# EAGLE design IUWASH_PIPE (EAGLE 6.5.0)
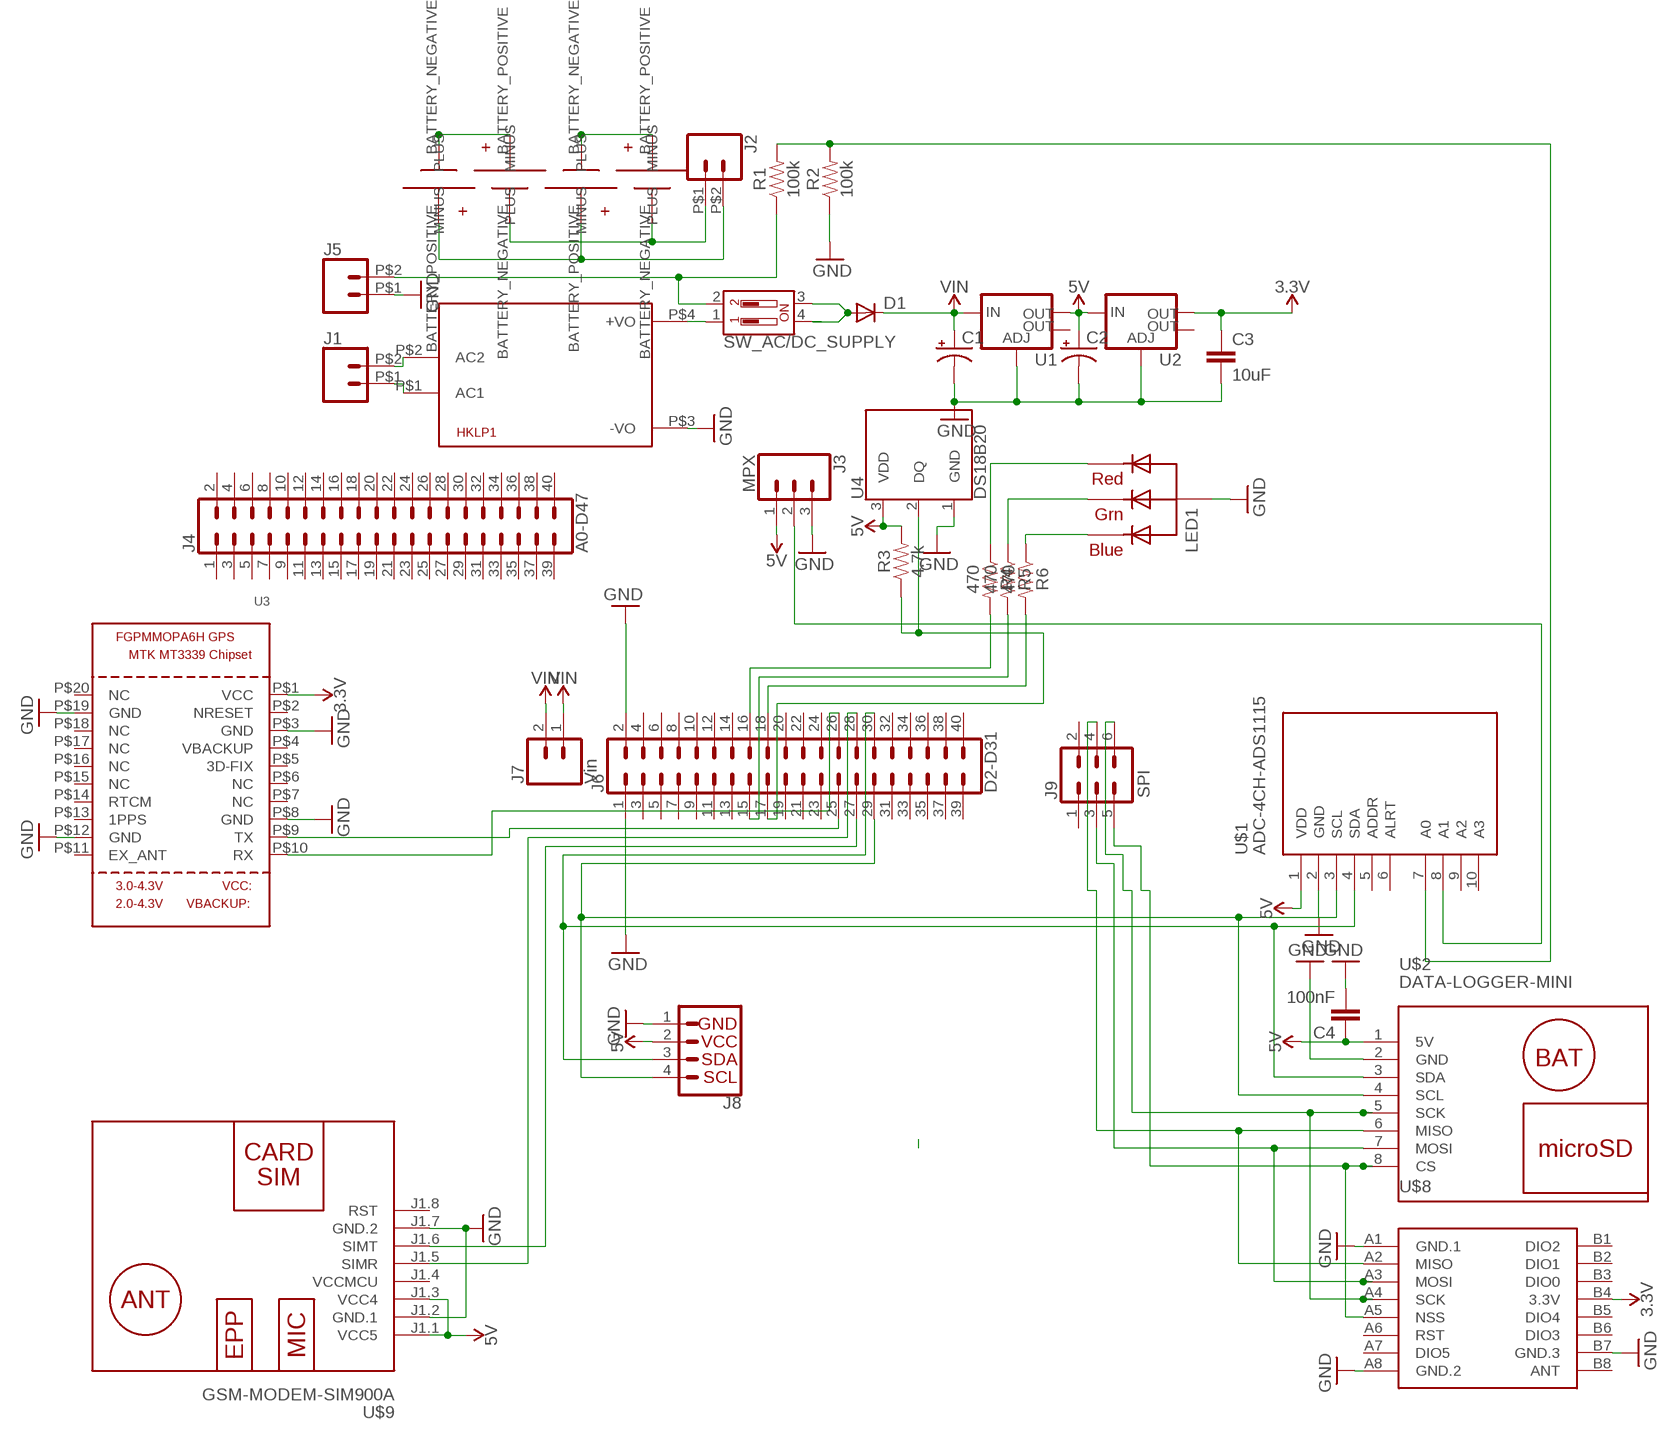
[diagram p0: schematic, sheet 1]

## Parts
C1  CPOL-USE  [PANASONIC_E]
C2  CPOL-USE  [PANASONIC_E]
C3  10uF  10UF-0603-6.3V-20%  [0603]
C4  100nF  10UF-0603-6.3V-20%  [0603]
D1  DIODE-SOD106-W  [SOD106-W]
HKLP1  HKLPM01  [HKLPM01]
J1  CONN_02PTH2  [1X02_BIG]
J2  CONN_02PTH2  [1X02_BIG]
J3  MPX  CONN_03SCREW  [SCREWTERMINAL-3.5MM-3]
J4  A0-D47  CONN_20X2  [2X20]
J5  CONN_02PTH2  [1X02_BIG]
J6  D2-D31  CONN_20X2  [2X20]
J7  Vin  CONN_02  [1X02]
J8  I2C_STANDARD  [1X04]
J9  SPI  CONN_03X2FEMALE  [2X3]
LED1  RGBLED_CA-5MM  [LED5MMRGB]
R1  100k  1KOHM-0603-1/10W-1%  [0603]
R2  100k  1KOHM-0603-1/10W-1%  [0603]
R3  4.7k  4.7KOHM-0603-1/10W-1%  [0603]
R4  470  1KOHM-0603-1/10W-1%  [0603]
R5  470  1KOHM-0603-1/10W-1%  [0603]
R6  470  1KOHM-0603-1/10W-1%  [0603]
SW_AC/DC_SUPPLY  DIP-02-PTH-100MIL  [DIPSWITCH-02-209-2LPST]
U1  V_REG_LM1117SOT223  [SOT223]
U2  V_REG_LM1117SOT223  [SOT223]
U3  GPS_FGPMMOPA6H  [FGPMMOPA6H]
U4  DS18B20  [TO-92-AMMO]
U$1  ADC-4CH-ADS1115  [ADC-4CH-ADS1115]
U$2  DATA-LOGGER-MINI  [DATA-LOGGER-MINI]
U$4  SMT18650  [18650SMT]
U$5  SMT18650  [18650SMT]
U$6  SMT18650  [18650SMT]
U$7  SMT18650  [18650SMT]
U$8  WIRELESS-LORA-RFM95W#SMD  [WIRELESS-LORA-RFM95W#SMD]
U$9  GSM-MODEM-SIM900A  [GSM-MODEM-SIM900A]

## Nets
3.3V: C3.1 U2.2(OUT) U3.P$1(VCC) U$8.B4(3.3V)
5V: C1.+ C2.+ C4.1 D1.C J3.1 J7.1 J7.2 R3.2 U1.2(OUT) U1.3(IN) U2.3(IN) U4.3(VDD) U$1.1(VDD) U$2.1(5V) U$9.J1.1(VCC5) U$9.J1.3(VCC4) ; supply symbol labelled VIN
GND: C4.2 HKLP1.P$3(-VO) J3.3 J5.P$1 J6.1 J6.2 LED1.2(VCC) R2.1 U3.P$3(GND) U3.P$8(GND) U3.P$12(GND) U3.P$19(GND) U$1.2(GND) U$2.2(GND) U$8.A1(GND.1) U$8.A8(GND.2) U$8.B7(GND.3) U$9.J1.2(GND.1) U$9.J1.7(GND.2)
N$1: J2.P$1 U$5.BATTERY_NEGATIVE(MINUS) U$7.BATTERY_NEGATIVE(MINUS)
N$2: J9.4 U$2.6(MISO) U$8.A2(MISO)
N$3: D1.A SW_AC/DC_SUPPLY.3 SW_AC/DC_SUPPLY.4
N$4: HKLP1.P$4(+VO) SW_AC/DC_SUPPLY.1
N$5: HKLP1.P$1(AC1) J1.P$1
N$6: HKLP1.P$2(AC2) J1.P$2
N$7: LED1.4(BLUE) R6.1
N$8: J3.2 U$1.8(A1)
N$9: J2.P$2 U$4.BATTERY_POSITIVE(PLUS) U$6.BATTERY_POSITIVE(PLUS)
N$10: U$4.BATTERY_NEGATIVE(MINUS) U$5.BATTERY_POSITIVE(PLUS)
N$11: U$6.BATTERY_NEGATIVE(MINUS) U$7.BATTERY_POSITIVE(PLUS)
N$12: R1.2 R2.2 U$1.7(A0)
N$13: J6.25 U3.P$9(TX)
N$14: J5.P$2 R1.1 SW_AC/DC_SUPPLY.2
N$15: J9.6 U$2.5(SCK) U$8.A4(SCK)
N$16: J9.3 U$2.7(MOSI) U$8.A3(MOSI)
N$17: J6.26 U3.P$10(RX)
N$19: J6.27 U$9.J1.6(SIMT)
N$20: J6.30 J8.3 U$1.4(SDA) U$2.3(SDA)
N$21: J6.29 J8.4 U$1.3(SCL) U$2.4(SCL)
N$22: J9.5 U$2.8(CS) U$8.A5(NSS)
N$23: J6.28 U$9.J1.5(SIMR)
N$31: J6.16 R4.2
N$32: J6.17 R3.1 U4.2(DQ)
N$33: J6.15 R5.2
N$34: LED1.3(GREEN) R5.1
N$35: LED1.1(RED) R4.1
N$36: J6.18 R6.2
N$56: C1.- C2.- C3.2 U1.1(ADJ) U2.1(ADJ) U4.1(GND) ; supply symbol labelled GND
Unconnected: J4.1 J4.2 J4.3 J4.4 J4.5 J4.6 J4.7 J4.8 J4.9 J4.10 J4.11 J4.12 J4.13 J4.14 J4.15 J4.16 J4.17 J4.18 J4.19 J4.20 J4.21 J4.22 J4.23 J4.24 J4.25 J4.26 J4.27 J4.28 J4.29 J4.30 J4.31 J4.32 J4.33 J4.34 J4.35 J4.36 J4.37 J4.38 J4.39 J4.40 J6.3 J6.4 J6.5 J6.6 J6.7 J6.8 J6.9 J6.10 J6.11 J6.12 J6.13 J6.14 J6.19 J6.20 J6.21 J6.22 J6.23 J6.24 J6.31 J6.32 J6.33 J6.34 J6.35 J6.36 J6.37 J6.38 J6.39 J6.40 J9.1 J9.2 U1.4(OUT) U2.4(OUT) U3.P$2(NRESET) U3.P$4(VBACKUP) U3.P$5(3D-FIX) U3.P$6(NC) U3.P$7(NC) U3.P$11(EX_ANT) U3.P$13(1PPS) U3.P$14(RTCM) U3.P$15(NC) U3.P$16(NC) U3.P$17(NC) U3.P$18(NC) U3.P$20(NC) U$1.5(ADDR) U$1.6(ALRT) U$1.9(A2) U$1.10(A3) U$8.A6(RST) U$8.A7(DIO5) U$8.B1(DIO2) U$8.B2(DIO1) U$8.B3(DIO0) U$8.B5(DIO4) U$8.B6(DIO3) U$8.B8(ANT) U$9.J1.8(RST)

## Power pins joined to a net without a drawn wire
1: J8.1
2: J8.2
VCCMCU: U$9.J1.4(VCCMCU)

## Library data of the parts
C1 C2 = adafruit:CPOL-US: POLARIZED CAPACITOR, American symbol
C3 = SparkFun-Capacitors:10UF: 10.0µF ceramic capacitors A capacitor is a passive two-terminal electrical component used to store electrical energy temporarily in an electric field.; PROD_ID: CAP-11015
C4 = SparkFun-Capacitors:10UF: 10.0µF ceramic capacitors A capacitor is a passive two-terminal electrical component used to store electrical energy temporarily in an electric field.; PROD_ID: CAP-11015; VALUE: 10uF
D1 = diode:DIODE-: DIODE
HKLP1 = HLKPM01EaglesLib:HKLPM01
J1 J2 J5 J7 = SparkFun-Connectors:CONN_02: Multi connection point. Often used as Generic Header-pin footprint for 0.1 inch spaced/style header connections On any of the 0.1 inch spaced packages, you can populate with these: Break Away Headers - Straight <https://www.sparkfun.com/products/116> (PRT-00116) Break Away Male Headers - Right Angle <https://www.sparkfun.com/products/553> (PRT-00553) Female Headers <https://www.sparkfun.com/products/115> (PRT-00115) Break Away Headers - Machine Pin <https://www.sparkfun.com/products/117> (PRT-00117) Break Away Female Headers - Swiss Machine Pin <https://www.sparkfun.com/products/743> (PRT-00743) For SCREWTERMINALS and SPRING TERMINALS visit here: Screw Terimnals on SparkFun.com <https://www.sparkfun.com/search/results?term=Screw+Terminals> (5mm/3.5mm/2.54mm spacing) This device is also useful as a general connection point to wire up your design to another part of your project. Our various solder wires solder well into these plated through hole pads. Hook-Up Wire - Assortment (Stranded, 22 AWG) <https://www.sparkfun.com/products/11375> (PRT-11375) Hook-Up Wire - Assortment (Solid Core, 22 AWG) <https://www.sparkfun.com/products/11367> (PRT-11367) View the entire wire category on our website here <https://www.sparkfun.com/categories/141> Special notes: Molex polarized connector foot print use with: PRT-08233 with associated crimp pins and housings. 2.54_SCREWTERM for use with PRT-10571. 3.5mm Screw Terminal footprints for PRT-08084 5mm Screw Terminal footprints for use with PRT-08432
J3 = SparkFun-Connectors:CONN_03: Multi connection point. Often used as Generic Header-pin footprint for 0.1 inch spaced/style header connections On any of the 0.1 inch spaced packages, you can populate with these: Break Away Headers - Straight <https://www.sparkfun.com/products/116> (PRT-00116) Break Away Male Headers - Right Angle <https://www.sparkfun.com/products/553> (PRT-00553) Female Headers <https://www.sparkfun.com/products/115> (PRT-00115) Break Away Headers - Machine Pin <https://www.sparkfun.com/products/117> (PRT-00117) Break Away Female Headers - Swiss Machine Pin <https://www.sparkfun.com/products/743> (PRT-00743) Stackable Header - 3 Pin (Female, 0.1") <https://www.sparkfun.com/products/13875> (PRT-13875) For SCREWTERMINALS and SPRING TERMINALS visit here: Screw Terimnals on SparkFun.com <https://www.sparkfun.com/search/results?term=Screw+Terminals> (5mm/3.5mm/2.54mm spacing) This device is also useful as a general connection point to wire up your design to another part of your project. Our various solder wires solder well into these plated through hole pads. Hook-Up Wire - Assortment (Stranded, 22 AWG) <https://www.sparkfun.com/products/11375> (PRT-11375) Hook-Up Wire - Assortment (Solid Core, 22 AWG) <https://www.sparkfun.com/products/11367> (PRT-11367) View the entire wire category on our website here <https://www.sparkfun.com/categories/141> Special notes: Molex polarized connector foot print use with SKU : PRT-08232 with associated crimp pins and housings.; PROD_ID: CONN-08288; SF_ID: PRT-08235
J4 J6 = SparkFun-Connectors:CONN_20X2: Multi connection point. Often used as Generic Header-pin footprint for 0.1 inch spaced/style header connections On any of the 0.1 inch spaced packages, you can populate with these: Break Away Headers - Straight <https://www.sparkfun.com/products/116> (PRT-00116) Break Away Male Headers - Right Angle <https://www.sparkfun.com/products/553> (PRT-00553) Female Headers <https://www.sparkfun.com/products/115> (PRT-00115) Break Away Headers - Machine Pin <https://www.sparkfun.com/products/117> (PRT-00117) Break Away Female Headers - Swiss Machine Pin <https://www.sparkfun.com/products/743> (PRT-00743)
J8 = SparkFun-Connectors:I2C_STANDARD: SparkFun I2C Standard Pinout Header SparkFun has standardized on a pinout for all I2C based sensor breakouts. This pinout allows I2C boards to be plugged directly into the headers on Arduino Uno compatible boards, and to be daisy chained easily. Example SparkFun Products: SparkFun Atmospheric Sensor Breakout - BME280 <https://www.sparkfun.com/products/13676> SparkFun Altitude/Pressure Sensor Breakout - MPL3115A2 <https://www.sparkfun.com/products/11084> SparkFun TOF Range Finder Sensor - VL6180 <https://www.sparkfun.com/products/12785>
J9 = SparkFun-Connectors:CONN_03X2: Multi connection point. Often used as Generic Header-pin footprint for 0.1 inch spaced/style header connections You can populate with any combo of single row headers, but if you'd like an exact match, check these: Header - 2x3 (Male, 0.1") <https://www.sparkfun.com/products/12807> (PRT-12807) Header - 2x3 (Female, 0.1") <https://www.sparkfun.com/products/13010> (PRT-13010) 2x3 Pin Shrouded Header <https://www.sparkfun.com/products/10877> (PRT-10877) On any of the 0.1 inch spaced packages, you can populate with these: Break Away Headers - Straight <https://www.sparkfun.com/products/116> (PRT-00116) Break Away Male Headers - Right Angle <https://www.sparkfun.com/products/553> (PRT-00553) Female Headers <https://www.sparkfun.com/products/115> (PRT-00115) Break Away Headers - Machine Pin <https://www.sparkfun.com/products/117> (PRT-00117) Break Away Female Headers - Swiss Machine Pin <https://www.sparkfun.com/products/743> (PRT-00743) Special note: the shrouded connector mates well with our 3x2 ribbon cables: Ribbon Crimp Connector - 6-pin (2x3, Female) <https://www.sparkfun.com/products/10651> (PRT-10651) Ribbon Cable - 6 wire (15ft) <https://www.sparkfun.com/products/10646> (PRT-10646); PROD_ID: CONN-11566; VALUE: FEMALE 2x3
LED1 = adafruit:RGBLED_CA: RGB LED, common-anode 5MM Staggered pins 5mm Piranha package http://www.ladyada.net/library/pcb/eaglelibrary.html
R1 R2 R4-R6 = SparkFun-Resistors:1KOHM: 1kΩ resistor A resistor is a passive two-terminal electrical component that implements electrical resistance as a circuit element. Resistors act to reduce current flow, and, at the same time, act to lower voltage levels within circuits. - Wikipedia; PROD_ID: RES-07856; VALUE: 1k
R3 = SparkFun-Resistors:4.7KOHM: 4.7kΩ resistor A resistor is a passive two-terminal electrical component that implements electrical resistance as a circuit element. Resistors act to reduce current flow, and, at the same time, act to lower voltage levels within circuits. - Wikipedia; PROD_ID: RES-07857
SW_AC/DC_SUPPLY = SparkFun-Switches:DIP-02: 2-Position DIP Switch 2-circuit DIP (dual inline package) switch. Commonly used to physcially set a circuit's behavior. Variants PTH-100MIL - Through-hole, 0.1"-Pitch Used on SparkFun Stepoko <https://www.sparkfun.com/products/13899> (ROB-13899) SMD-50MIL-JWING - SMD (J-Wing Pads), 0.05"-Pitch Prototype Part SMD-50MIL - SMD, 0.05"-Pitch Used on SparkFun Battery Babysitter <https://www.sparkfun.com/products/13777> (PRT-13777); PROD_ID: SWCH-12532
U1 U2 = SparkFun-IC-Power:V_REG_LM1117: Voltage Regulator LM1117 Standard adjustable voltage regulator but in SMD form. Spark Fun Electronics SKU : COM-00595; PROD_ID: VREG-08170
U3 = adafruit:GPS_FGPMMOPA6H: GPS Module - MTK MT3339 Chipset, -165dBm sensitivity, 22 channels, 10Hz, auto-select external antenna options
U4 = SparkFun-Sensors:DS18B20: Dallas/Maxim DS18B20 1-Wire Temperature Sensor The DS18B20 reports degrees C with 9 to 12-bit precision, -55C to 125C (+/-0.5C). Each sensor has a unique 64-Bit Serial number etched into it - allows for a huge number of sensors to be used on one data bus. Datasheet <http://datasheets.maximintegrated.com/en/ds/DS18B20.pdf> SparkFun Products One Wire Digital Temperature Sensor - DS18B20 <https://www.sparkfun.com/products/245> (SEN-00245); STORE_ID: SEN-00245
U$1 = diy-modules:ADC-4CH-ADS1115: 4 Channel 16-Bit Analog-to-Digital Converter based on ADS1115 chip Arduino ADS1115 Getting Started Tutorial is available here: http://henrysbench.capnfatz.com/henrys-bench/arduino-voltage-measurements/arduino-ads1115-module-getting-started-tutorial/ ADS1115 datasheet is available here: http://www.ti.com/lit/ds/symlink/ads1115.pdf Click here to find device on ebay.com <http://www.ebay.com/sch/ads1115+module>
U$2 = diy-modules:DATA-LOGGER-MINI: Mini Data Logger with microSD card and battery powered RTC based on DS1307 chip Arduino library for DS1307 and description are available here: https://www.pjrc.com/teensy/td_libs_DS1307RTC.html Tutorial how to use SD card with Arduino: https://www.arduino.cc/en/reference/SD Click here to find device on ebay.com <http://www.ebay.com/sch/mini+data+logger+arduino>
U$4-U$7 = SMT18650:SMT18650
U$8 = diy-modules:WIRELESS-LORA-RFM95W: 868/915 MHz LoRa Radio Transceiver Module based on SX1276 chip Click here to find device on ebay.com <http://www.ebay.com/sch/RFM95W+transceiver>
U$9 = diy-modules:GSM-MODEM-SIM900A: GSM Mini Module based on SIM900A Schematic available here: http://www.electrodragon.com/w/SIM900_(SIM900A)_Mini_DEV_Board

## Board
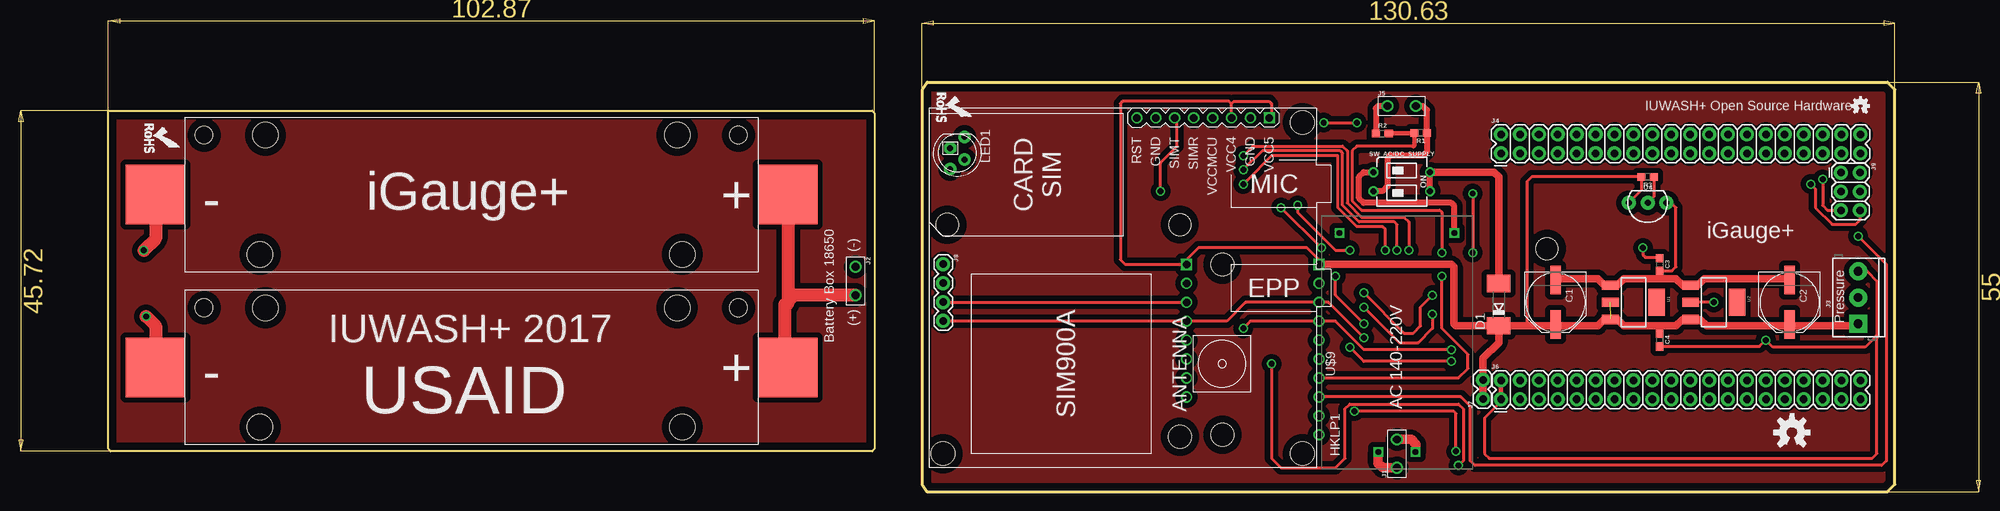
[diagram p1: board, top side]
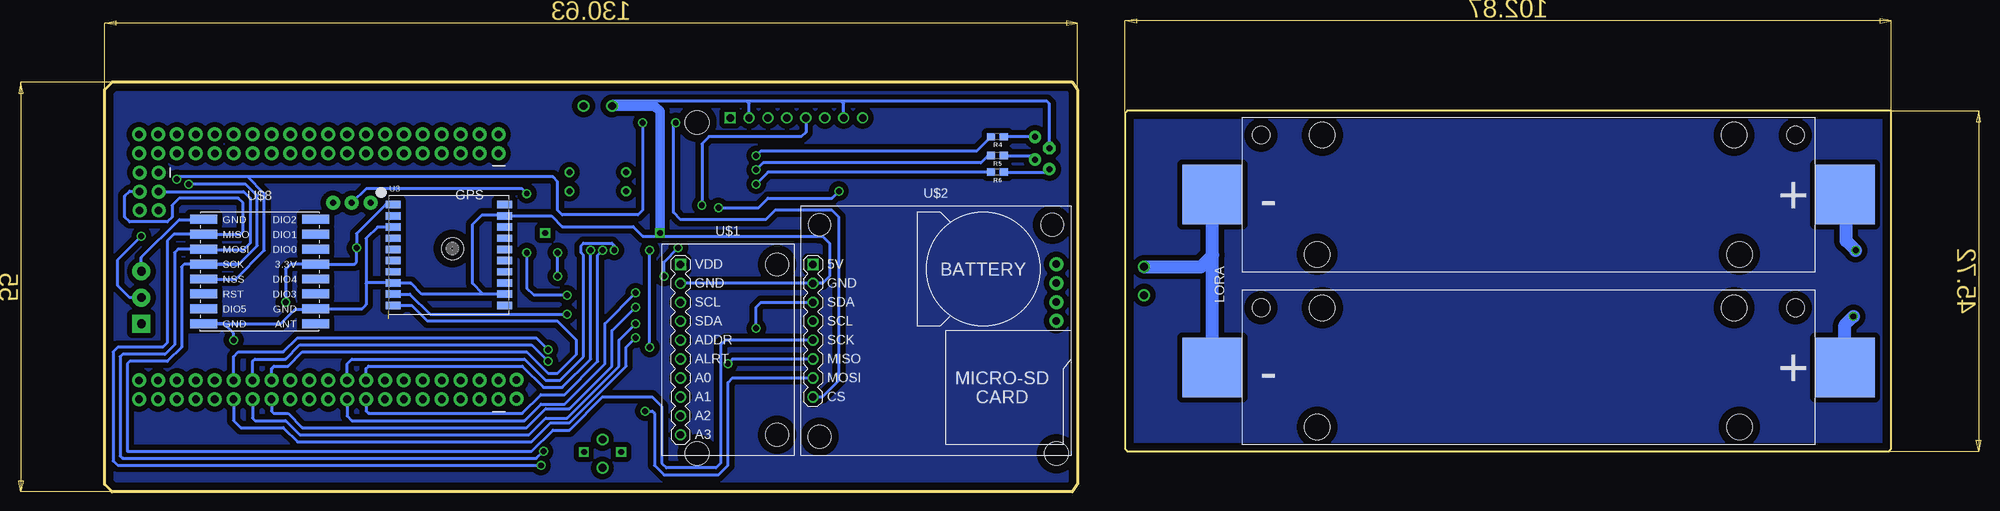
[diagram p2: board, bottom side, seen from below]

Size 239.9 x 55 mm. Coordinates in mm from the lower left corner, seen from the top.
Outline: 109.26,54 109.95,55 238.9,55 239.9,54 239.9,1 238.9,0 109.95,0 109.26,1 109.26,54
Outline: 102.55,51.17 102.87,50.85 102.87,5.77 102.55,5.45 0.32,5.45 0,5.77 0,51.17 102.55,51.17
Copper layers (1*16): Top 0.035mm / dielectric 1.5mm / Bottom 0.035mm
Design rules "default *": minimum track width 10mil, minimum drill 24mil, track to track 28mil, track to pad 28mil, pad to pad 28mil, via to via 28mil, smd to smd 28mil, copper to edge 40mil, drill to drill 8mil, minimum pad ring 10mil, minimum via ring 8mil, stop-mask expansion 4mil, vias tented up to drill 0mil, thermal gap 10mil

### Footprints (pad centres in the part's own frame; a part is rotated, then mirrored left to right if it is on the bottom)
PANASONIC_E = smd 3.8 x 1.4: + 3,0; - -3,0
0603 = smd 1.1 x 1: 1 -0.85,0; 2 0.85,0
SOD106-W = smd 2.3 x 3.2: A 2.85,0; C -2.85,0
HKLPM01 = drill 0.8 square: P$1 -14.7,2.5; P$2 -14.7,-2.5; P$3 14.7,7.7; P$4 14.7,-7.7
1X02_BIG = drill 1.067: P$1 0,0; P$2 3.81,0
SCREWTERMINAL-3.5MM-3 = drill 1.2 pad 2.413 square: 1 0,0 | drill 1.2 pad 2.413: 2 3.5,0; 3 7,0
2X20 = drill 1.016 pad 1.88: 1 0,0; 2 0,2.54; 3 2.54,0; 4 2.54,2.54; 5 5.08,0; 6 5.08,2.54; 7 7.62,0; 8 7.62,2.54; 9 10.16,0; 10 10.16,2.54; 11 12.7,0; 12 12.7,2.54; 13 15.24,0; 14 15.24,2.54; 15 17.78,0; 16 17.78,2.54; 17 20.32,0; 18 20.32,2.54; 19 22.86,0; 20 22.86,2.54; 21 25.4,0; 22 25.4,2.54; 23 27.94,0; 24 27.94,2.54; 25 30.48,0; 26 30.48,2.54; 27 33.02,0; 28 33.02,2.54; 29 35.56,0; 30 35.56,2.54; 31 38.1,0; 32 38.1,2.54; 33 40.64,0; 34 40.64,2.54; 35 43.18,0; 36 43.18,2.54; 37 45.72,0; 38 45.72,2.54; 39 48.26,0; 40 48.26,2.54
1X02 = drill 1.016 pad 1.88: 1 0,0; 2 2.54,0
1X04 = drill 1.016 pad 1.88: 1 0,0; 2 2.54,0; 3 5.08,0; 4 7.62,0
2X3 = drill 1.016 pad 1.88: 1 0,0; 2 0,2.54; 3 2.54,0; 4 2.54,2.54; 5 5.08,0; 6 5.08,2.54
LED5MMRGB = drill 0.8 pad 1.676: 1 -2.159,0.968; 3 0.889,0.968; 4 2.159,-0.968 | drill 0.8 pad 1.676 octagon: 2 -0.635,-0.968
DIPSWITCH-02-209-2LPST = drill 0.8: 1 -1.27,-3.81; 2 1.27,-3.81; 3 1.27,3.81; 4 -1.27,3.81
SOT223 = smd 1.219 x 2.235: 1 -2.311,-3.099; 2 0,-3.099; 3 2.311,-3.099 | smd 3.6 x 2.2: 4 0,3.099
FGPMMOPA6H = smd 2 x 1: P$1 -7.5,6.75; P$2 -7.5,5.25; P$3 -7.5,3.75; P$4 -7.5,2.25; P$5 -7.5,0.75; P$6 -7.5,-0.75; P$7 -7.5,-2.25; P$8 -7.5,-3.75; P$9 -7.5,-5.25; P$10 -7.5,-6.75; P$11 7.5,-6.75; P$12 7.5,-5.25; P$13 7.5,-3.75; P$14 7.5,-2.25; P$15 7.5,-0.75; P$16 7.5,0.75; P$17 7.5,2.25; P$18 7.5,3.75; P$19 7.5,5.25; P$20 7.5,6.75 | hole 3: 0.5,0.85
TO-92-AMMO = drill 0.813 pad 1.88: 1 -2.54,0; 2 0,0; 3 2.54,0
ADC-4CH-ADS1115 = drill 1 square: 1 -6.35,11.43 | drill 1: 2 -6.35,8.89; 3 -6.35,6.35; 4 -6.35,3.81; 5 -6.35,1.27; 6 -6.35,-1.27; 7 -6.35,-3.81; 8 -6.35,-6.35; 9 -6.35,-8.89; 10 -6.35,-11.43 | hole 3.1: 6.604,11.43; 6.604,-11.43
DATA-LOGGER-MINI = drill 1 square: 1 -16.51,8.89 | drill 1: 2 -16.51,6.35; 3 -16.51,3.81; 4 -16.51,1.27; 5 -16.51,-1.27; 6 -16.51,-3.81; 7 -16.51,-6.35; 8 -16.51,-8.89 | hole 3: -15.621,14.224 | hole 3.1: -15.621,-14.224; 15.621,14.224
18650SMT = smd 8 x 8: BATTERY_NEGATIVE 80.98,10.32; BATTERY_POSITIVE -3.95,10.32 | hole 3.45: 66.925,18.325; 10.925,2.325 | hole 2.39: 74.455,2.325
WIRELESS-LORA-RFM95W#SMD = smd 3.6 x 1.2: A1 -7.5,7; A2 -7.5,5; A3 -7.5,3; A4 -7.5,1; A5 -7.5,-1; A6 -7.5,-3; A7 -7.5,-5; A8 -7.5,-7; B1 7.5,7; B2 7.5,5; B3 7.5,3; B4 7.5,1; B5 7.5,-1; B6 7.5,-3; B7 7.5,-5; B8 7.5,-7
GSM-MODEM-SIM900A = drill 1 square: J1.1 -22.86,20.32 | drill 1: J1.2 -22.86,17.78; J1.3 -22.86,15.24; J1.4 -22.86,12.7; J1.5 -22.86,10.16; J1.6 -22.86,7.62; J1.7 -22.86,5.08; J1.8 -22.86,2.54 | hole 3.2: -22.225,24.765; 22.225,24.765; 22.225,-23.495

### Placement (x,y rotation side)
C1  194.31,25.45 270 top
C2  225.74,25.45 270 top
C3  208.28,30.53 270 top
C4  208.28,20.37 270 top
D1  186.69,25.14 90 top
HKLP1  173.04,20.05 90 top
J1  173.04,3.23 90 top
J2  100.33,30.22 270 top
J3  234.95,22.59 90 top
J4  187.01,45.45 0 top
J5  171.77,51.81 0 top
J6  187.01,12.44 0 top
J7  184.59,12.49 90 top
J8  112.11,30.57 270 top
J9  232.66,42.86 270 top
LED1  114,45.5 270 top
R1  176.22,48.2 180 top
R2  171.06,48.12 0 top
R3  206.69,42.28 180 top
R4  120.02,47.68 180 bottom
R5  120.02,45.14 180 bottom
R6  120.02,42.92 180 bottom
SW_AC/DC_SUPPLY  173.67,41.64 270 top
U1  204.79,25.45 270 top
U2  215.58,25.45 270 top
U3  193.68,31.8 0 bottom
U4  206.69,38.79 180 top
U$1  156.21,19.1 0 bottom
U$2  128.27,21.64 0 bottom
U$3  [OSHW-LOGO-M]  226.06,7.99 0 top
U$4  87.31,27.04 180 top
U$5  10.16,27.04 180 bottom
U$6  87.31,50.22 180 top
U$7  10.16,50.22 180 bottom
U$8  219.08,29.58 0 bottom
U$9  135.58,27.36 270 top
U$10  [OSHW-LOGO-MINI]  235.27,51.81 0 top
U$11  [ROHS_LOGO_0.18_IN]  111.13,53.71 270 top
U$12  [ROHS_LOGO_0.18_IN]  4.76,49.58 270 top

### Tracks (layer width: path | path; a pad name or v marks a point on that pad's centre or on a via)
3.3V  (via drill 0.8)
  Top 0.406: v215.58,25.45 U2.2 | v206.06,32.75 206.06,31.8 206.38,31.48 208.18,31.48 C3.1
  Bottom 0.406: v215.58,25.45 215.58,29.9 214.9,30.58 U$8.B4 206.33,30.58 206.06,30.85 v206.06,32.75 206.06,34.66 202.16,38.55 U3.P$1
5V  (1 unrouted)
  Top 0.406: U4.3 205.84,40.48 R3.2 191.14,42.28 190.5,41.64 190.5,22.28 | U$9.J1.1 156.21,50.53 156.21,52.12 155.89,52.44 151.13,52.44 150.82,52.13 U$9.J1.3 150.82,52.12 150.5,52.44 136.21,52.44 135.89,52.12 135.89,31.17 136.53,30.53 U$2.1 144.78,31.17 146.37,32.75 160.97,32.75 162.56,31.17 U$1.1
  Top 1.016: J7.1 J7.2 184.59,17.96 186.69,20.05 D1.C | D1.C 190.5,22.28 194.14,22.28 C1.+ 194.49,22.28 200.03,22.28 200.98,23.23 201.6,23.23 U1.3 201.78,23.23 202.57,23.23 203.52,22.28 208.6,22.28 | J3.1 234.63,22.28 225.74,22.28 C2.+ 225.57,22.28 214.63,22.28 213.77,23.14 U2.3 211.37,23.14 210.5,22.28 208.6,22.28 | U$1.1 180.34,30.53 180.66,30.22 180.66,22.59 180.97,22.28 186.68,22.28 D1.C | C4.1 208.28,21.96 208.6,22.28
GND  (via drill 0.8)
  Top 0.406: J3.3 236.21,29.59 237.49,28.31 237.49,21.01 237.33,20.85 | 237.33,20.85 235.9,19.42 223.52,19.42 v222.57,20.37 221.72,19.52 C4.2 | J6.1 187.01,12.12 184.78,9.9 184.78,5.13 185.42,4.5 236.85,4.5 237.49,5.13 237.49,20.69 237.33,20.85
  Top 0.61: J6.1 J6.2
  Top 0.813: J5.P$1 170.5,51.81 170.18,51.49 170.18,48.15 R2.1
  Bottom 0.406: J3.3 234.95,31.48 229.87,36.56 226.59,36.56 U$8.A1 | 204.79,27.99 204.79,34.03 203.26,35.55 U3.P$3 | 204.79,27.99 204.79,25.14 205.34,24.58 U$8.B7 211.66,24.5 214.31,24.5 216.23,22.58 U$8.A8 226.56,22.59 223.84,22.59 222.57,21.33 v222.57,20.37 | 165.42,34.67 165.75,34.34 167.64,34.34 168.91,35.61 178.44,35.61 179.88,37.05 U3.P$19 186.32,37.2 189.23,37.2 190.5,35.93 190.5,27.99 189.06,26.55 U3.P$12 197.31,26.55 198.76,27.99 201.11,27.99 U3.P$8 204.73,28.05 204.79,27.99 | U$9.J1.7 140.66,52.13 140.97,52.44 | 140.97,52.44 153.67,52.44 | 153.67,52.44 171.77,52.44 J5.P$1 | U$9.J1.2 153.36,52.13 153.67,52.44 | LED1.2 113.03,52.12 113.35,52.44 140.97,52.44 | U$1.2 U$2.2 143.51,27.99 142.56,28.94 142.56,33.39 143.51,34.34 165.42,34.34 165.42,34.67 | 165.42,34.67 HKLP1.P$3
  Bottom 1.27: HKLP1.P$3 165.34,51.09 166.05,51.81 J5.P$1
N$1
  Bottom 1.778: J2.P$1 92.71,30.22 91.14,31.78 | U$7.BATTERY_NEGATIVE 91.12,39.88 91.12,31.8 91.14,31.78 | U$5.BATTERY_NEGATIVE 91.14,31.78
N$2  (via drill 0.8)
  Top 0.406: v156.21,17.2 156.21,4.5 157.48,3.23 164.78,3.23 166.05,4.5 166.05,11.16 166.69,11.8 181.29,11.8 181.93,11.16 181.93,4.18 v181.29,3.55
  Bottom 0.406: v181.29,3.55 238.13,3.55 238.76,4.18 238.76,18.78 238.13,19.42 232.09,19.42 231.46,20.05 231.46,33.71 230.59,34.58 U$8.A2 221.7,34.58 221.3,34.98 221.3,38.79 221.93,39.42 229.87,39.42 230.82,38.47 230.82,36.88 231.46,36.25 236.54,36.25 237.17,36.88 237.17,39.74 236.54,40.38 235.26,40.38 J9.4 | U$2.6 155.58,17.83 v156.21,17.2
N$3
  Top 0.813: SW_AC/DC_SUPPLY.3 SW_AC/DC_SUPPLY.4
  Top 1.016: D1.A 186.69,42.28 186.06,42.92 SW_AC/DC_SUPPLY.4
N$4
  Top 0.813: HKLP1.P$4 180.74,38.39 180.34,38.79 168.59,38.79 167.96,39.42 167.96,42.28 168.59,42.92 SW_AC/DC_SUPPLY.1
N$5
  Top 1.27: J1.P$1 171.13,3.23 170.5,3.86 170.5,5.31 HKLP1.P$1
N$6
  Top 1.27: J1.P$2 174.94,7.04 175.58,6.4 175.58,5.4 HKLP1.P$2
N$7
  Bottom 0.406: R6.1 113.46,42.92 LED1.4
N$8  (via drill 0.8)
  Top 0.406: v234.95,34.34 238.76,30.53 238.76,4.18 238.13,3.55 183.52,3.55 182.88,4.18 182.88,11.48 181.61,12.75 U$1.8
  Bottom 0.406: J3.2 236.54,26.09 238.13,27.67 238.13,31.17 v234.95,34.34
N$9
  Top 1.778: J2.P$2 92.08,26.41 90.81,25.14 90.81,24.82 | 90.81,24.82 90.81,17.18 U$4.BATTERY_POSITIVE | U$6.BATTERY_POSITIVE 91.26,25.28 90.81,24.82
N$10  (via drill 0.8)
  Top 1.778: v5.08,23.55 6.35,22.28 6.35,16.74 U$4.BATTERY_NEGATIVE
  Bottom 1.778: U$5.BATTERY_POSITIVE 6.21,22.42 v5.08,23.55
N$11  (via drill 0.8)
  Top 1.778: U$6.BATTERY_NEGATIVE 6.33,34.01 v4.76,32.44
  Bottom 1.778: v4.76,32.44 6.03,33.71 6.03,39.72 U$7.BATTERY_POSITIVE
N$12  (via drill 0.8)
  Top 0.406: U$1.7 181.29,15.29 182.56,16.56 182.56,18.47 179.07,21.96 v179.07,28.94 | v179.07,32.12 179.07,37.52 178.75,37.83 168.28,37.83 167,39.11 167,45.77 167.64,46.41 175.26,46.41
  Top 0.61: R2.2 175.28,48.12 R1.2 175.37,46.52 175.26,46.41
  Bottom 0.406: v179.07,28.94 v179.07,32.12
N$13  (via drill 0.8)
  Top 0.406: v168.59,24.82 173.36,20.05 175.9,20.05 177.8,21.96 v177.8,23.87
  Bottom 0.406: J6.25 217.49,10.85 217.17,10.53 215.27,10.53 213.36,8.62 183.2,8.62 180.66,11.16 177.48,11.16 171.77,16.88 171.77,21.64 v168.59,24.82 | U3.P$9 198.9,26.55 196.22,23.87 v177.8,23.87
N$14
  Top 0.813: J5.P$2 176.53,51.81 177.07,51.27 R1.1 177.07,45.68 176.53,45.14 172.09,45.14 171.77,44.82 171.77,41.01 171.13,40.38 SW_AC/DC_SUPPLY.2
N$15  (via drill 0.8)
  Top 0.406: v228.6,41.33 229.23,40.69 229.23,38.15 231.46,35.93 234.63,35.93 235.27,36.56 235.27,37.71 J9.6
  Bottom 0.406: U$8.A4 221.89,30.58 | 221.89,30.58 219.39,33.07 219.39,39.74 220.98,41.33 v228.6,41.33 | 221.89,30.58 221.93,30.53 229.23,30.53 229.55,30.22 229.55,19.42 231.46,17.52 236.54,17.52 236.85,17.2 236.85,5.45 182.56,5.45 179.71,8.31 177.48,8.31 173.04,12.75 166.37,12.75 165.1,11.48 165.1,3.86 164.47,3.23 157.8,3.23 157.16,3.86 157.16,19.74 156.53,20.37 U$2.5
N$16  (via drill 0.8)
  Top 0.406: v180.97,5.45 180.97,10.53 180.66,10.85 v167.32,10.85
  Bottom 0.406: J9.3 221.24,40.32 220.34,39.42 220.34,33.39 221.3,32.44 226.43,32.44 U$8.A3 230.04,32.58 230.51,32.12 230.51,19.74 231.78,18.47 237.49,18.47 237.81,18.15 237.81,4.81 237.49,4.5 181.93,4.5 v180.97,5.45 | U$2.7 155.58,15.29 156.21,14.66 156.21,3.55 157.48,2.27 164.78,2.27 166.05,3.55 166.05,10.53 166.37,10.85 v167.32,10.85
N$17
  Bottom 0.406: J6.26 217.49,16.56 217.17,16.88 215.27,16.88 213.36,18.78 183.2,18.78 180.34,15.93 179.07,15.93 176.53,18.47 176.53,20.37 179.07,22.91 196.53,22.91 198.67,25.05 U3.P$10
N$18
  pour Bottom: 109.54,53.71 109.54,54.03 110.17,54.66 238.76,54.66 239.4,54.03 239.4,1.01 238.76,0.37 110.17,0.37 109.54,1.01
N$19  (via drill 0.8)
  Top 0.406: v168.59,22.59 164.78,26.41 v164.78,28.94 | v162.88,32.75 v157.48,38.15 | v141.29,40.38 141.29,44.19 143.51,46.41 143.51,49.91 U$9.J1.6
  Bottom 0.406: J6.27 220.03,9.9 219.71,9.58 215.58,9.58 213.68,7.67 182.88,7.67 180.66,9.9 177.8,9.9 170.81,16.88 170.81,20.37 v168.59,22.59 | v164.78,28.94 164.78,30.85 v162.88,32.75 | v157.48,38.15 152.08,38.15 150.81,39.42 142.24,39.42 v141.29,40.38
N$20  (via drill 0.8)
  Top 0.406: J8.3 144.74,25.49 U$2.3 | v180.34,19.1 168.59,19.1 164.78,22.91 U$1.4 153.35,22.91 v152.4,21.96
  Bottom 0.406: J6.30 222.57,18.15 221.93,18.78 215.9,18.78 214,20.69 181.93,20.69 v180.34,19.1 | v152.4,21.96 152.4,24.82 151.77,25.45 U$2.3
N$21  (via drill 0.8)
  Top 0.406: J8.4 112.15,22.91 U$2.4 150.18,22.91 152.72,25.45 U$1.3 163.83,25.45 v168.59,20.69
  Bottom 0.406: J6.29 222.57,9.58 221.61,8.62 215.9,8.62 214,6.72 182.56,6.72 180.02,9.26 177.48,9.26 169.86,16.88 169.86,19.42 v168.59,20.69
N$22  (via drill 0.8)
  Top 0.406: v230.19,41.96 230.19,38.47 230.82,37.83 232.6,37.83 J9.5 | v163.2,49.58 v167.64,49.58
  Bottom 0.406: U$8.A5 222.3,28.58 218.44,32.44 218.44,40.06 220.66,42.28 | 220.66,42.28 229.87,42.28 v230.19,41.96 | U$2.8 143.51,12.75 141.29,14.98 141.29,36.88 142.24,37.83 149.86,37.83 151.13,36.56 162.56,36.56 163.51,37.52 163.51,49.27 v163.2,49.58 | 220.66,42.28 179.71,42.28 179.07,41.64 179.07,37.83 178.44,37.2 168.28,37.2 167.64,37.83 v167.64,49.58
N$23  (via drill 0.8)
  Top 0.406: v180.34,17.52 168.59,17.52 v166.69,19.42 | v159.7,38.47 159.7,37.52 164.78,32.44 v166.69,32.44
  Bottom 0.406: J6.28 220.03,17.51 219.71,17.83 215.58,17.83 213.68,19.74 182.56,19.74 v180.34,17.52 | U$9.J1.5 145.74,48.31 146.37,47.68 158.75,47.68 159.7,46.72 v159.7,38.47 | v166.69,19.42 v166.69,32.44
N$24
  pour Top: 110.17,54.66 109.54,54.03 109.54,1.01 110.17,0.37 238.76,0.37 239.4,1.01 239.4,54.03 238.76,54.66
N$25
  pour Top: 0.32,6.09 0.64,5.77 102.24,5.77 102.55,6.09 102.55,50.53 102.24,50.85 0.64,50.85 0.32,50.53
N$26
  pour Bottom: 0.32,50.53 0.64,50.85 102.24,50.85 102.55,50.53 102.55,6.09 102.24,5.77 0.64,5.77 0.32,6.09
N$31  (via drill 0.8)
  Top 0.406: v152.4,45.14 153.67,46.41 165.74,46.41 166.37,45.77 166.37,38.79 168.28,36.88 173.99,36.88 174.62,36.25 v174.62,32.44
  Bottom 0.406: J6.16 204.79,16.56 204.47,16.88 183.83,16.88 180.97,14.02 178.44,14.02 174.62,17.83 v174.62,32.44 | v152.4,45.14 151.77,45.77 122.77,45.77 R4.2
N$32  (via drill 0.8)
  Top 0.406: R3.1 207.54,39.64 U4.2 | v168.59,26.72 173.99,21.33 175.26,21.33 176.21,22.28 176.21,24.82 v177.8,26.41 | v183.2,40.06 v183.2,32.12
  Bottom 0.406: J6.17 207.33,10.22 206.69,9.58 183.52,9.58 181.29,11.8 178.12,11.8 172.72,17.2 172.72,22.59 v168.59,26.72 | v177.8,26.41 182.25,26.41 183.2,27.36 v183.2,32.12 | v183.2,40.06 183.83,40.69 204.79,40.69 U4.2
N$33  (via drill 0.8)
  Top 0.406: v173.04,32.44 173.04,35.93 172.72,36.25 167.96,36.25 165.74,38.47 165.74,45.45 165.42,45.77 154.94,45.77 152.72,43.55 v152.4,43.23
  Bottom 0.406: J6.15 204.79,10.85 204.47,10.53 183.83,10.53 181.29,13.07 178.12,13.07 173.67,17.52 173.67,31.8 v173.04,32.44 | R5.2 121.28,45.14 122.24,44.19 151.45,44.19 v152.4,43.23
N$34
  Bottom 0.406: R5.1 115.49,45.14 LED1.3
N$35
  Bottom 0.406: LED1.1 119.15,47.66 R4.1
N$36  (via drill 0.8)
  Top 0.406: v171.45,32.44 171.45,35.3 171.13,35.61 167.64,35.61 165.1,38.15 165.1,45.14 156.21,45.14 152.88,41.8 v152.4,41.33
  Bottom 0.406: J6.18 207.33,17.2 206.69,17.83 183.52,17.83 180.66,14.98 178.75,14.98 175.58,18.15 175.58,31.8 175.9,32.12 175.9,33.07 175.58,33.39 171.77,33.39 171.45,33.07 v171.45,32.44 | R6.2 150.81,42.92 v152.4,41.33
N$56
  Top 0.406: C3.2 209.97,29.68 210.5,30.22 210.5,38.15 209.87,38.79 U4.1
  Top 1.016: C1.- 194.49,28.63 200.03,28.63 200.89,27.76 U1.1 202.65,27.76 203.52,28.63 208.28,28.63 | C2.- 225.57,28.63 214.31,28.63 213.45,27.76 U2.1 212.4,27.67 211.46,27.67 210.5,28.63 208.28,28.63 | C3.2 208.28,28.63

### Text on the board
tNames: IUWASH+ Open Source Hardware | iGauge+ | Battery Box 18650 | (-) | iGauge+ | Pressure | (+) | IUWASH+ 2017 | USAID | AC 140-220V
bNames: GPS | LORA | 18650 Battery | USAID